# Altium schematic sheet Voltage_source.SchDoc
size A3; SheetNumber: 2; SheetTotal: 3
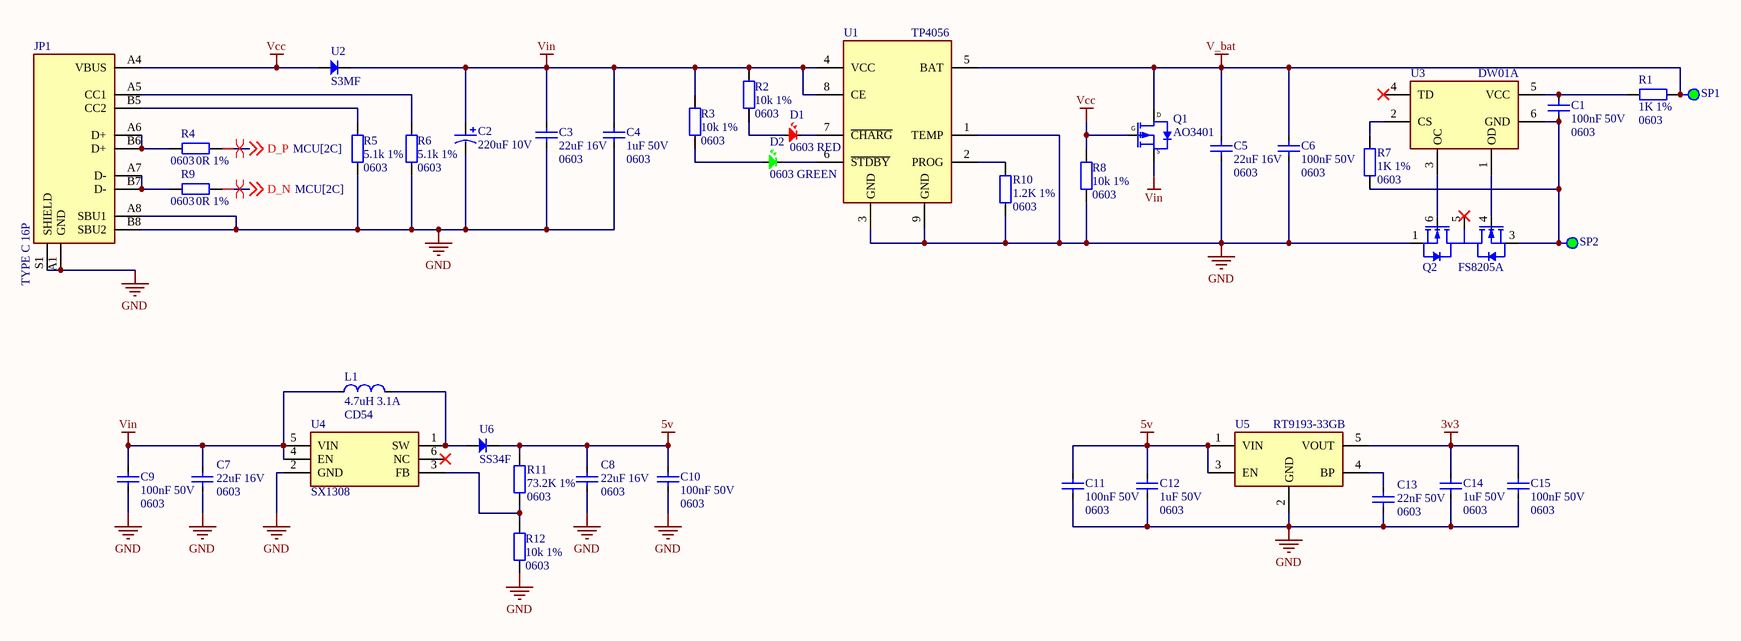
[diagram p0: Voltage_source.SchDoc]

## Parts
C1  100nF 50V  Package: 0603  [C_0603]
C2  220uF 10V  [CAP-ALU-SMD-D-NEW]
C3  22uF 16V  Package: 0603  [C_0603]
C4  1uF 50V  Package: 0603  [C_0603]
C5  22uF 16V  Package: 0603  [C_0603]
C6  100nF 50V  Package: 0603  [C_0603]
C7  22uF 16V  Package: 0603  [C_0603]
C8  22uF 16V  Package: 0603  [C_0603]
C9  100nF 50V  Package: 0603  [C_0603]
C10  100nF 50V  Package: 0603  [C_0603]
C11  100nF 50V  Package: 0603  [C_0603]
C12  1uF 50V  Package: 0603  [C_0603]
C13  22nF 50V  Package: 0603  [C_0603]
C14  1uF 50V  Package: 0603  [C_0603]
C15  100nF 50V  Package: 0603  [C_0603]
D1  0603 RED  [LED0603_RED]
D2  0603 GREEN  [LED0603_GREEN]
JP1  TYPE C 16P  [TYPE C 16P]
L1  4.7uH 3.1A  [CD54]
Q1  AO3401  [SOT23-3]
Q2  FS8205A  [SOT23-6]
R1  1K 1%  Package: 0603  [R_0603]
R2  10k 1%  Package: 0603  [R_0603]
R3  10k 1%  Package: 0603  [R_0603]
R4  0R 1%  Package: 0603  [R_0603]
R5  5.1k 1%  Package: 0603  [R_0603]
R6  5.1k 1%  Package: 0603  [R_0603]
R7  1K 1%  Package: 0603  [R_0603]
R8  10k 1%  Package: 0603  [R_0603]
R9  0R 1%  Package: 0603  [R_0603]
R10  1.2K 1%  Package: 0603  [R_0603]
R11  73.2K 1%  Package: 0603  [R_0603]
R12  10k 1%  Package: 0603  [R_0603]
SP1  SP  [SOLDERING PAD BIG 2]  (value not drawn)
SP2  SP  [SOLDERING PAD BIG 2]  (value not drawn)
U1  TP4056  [ESOP-8]
U2  S3MF  [SMAF_L3.5-W2.6-LS4.7-RD]
U3  DW01A  [SOT23-6]
U4  SX1308  [SOT23-6]
U5  RT9193-33GB  [SOT23-5]
U6  SS34F  [SMAF_L3.5-W2.6-LS4.7-RD]

## Nets
3v3: C14.2 C15.2 U5.5(VOUT)
5v: C8.2 C10.2 C11.2 C12.2 R11.2 U5.1(VIN) U5.3(EN) U6.1
GND: C2.2 C3.1 C4.1 C5.1 C6.1 C7.1 C8.1 C9.1 C10.1 C11.1 C12.1 C13.1 C14.1 C15.1 JP1.A1(GND) JP1.A8(SBU1) JP1.B8(SBU2) JP1.S1(SHIELD) Q2.1(S1) R5.1 R6.1 R8.2 R10.1 R12.1 U1.1(TEMP) U1.3(GND) U1.9(GND) U4.2(GND) U5.2(GND)
V_bat: C5.2 C6.2 Q1.3(D) R1.2 SP1.1 U1.5(BAT)
Vcc: JP1.A4(VBUS) Q1.1(G) R8.1 U2.2
Vin: C2.1 C3.2 C4.2 C7.2 C9.2 L1.1 Q1.2(S) R2.1 R3.1 U1.4(VCC) U1.8(CE) U2.1 U4.4(EN) U4.5(VIN)
D_N: R9.2 ; off-sheet D_N
D_P: R4.2 ; off-sheet D_P
NetC1_1: C1.1 Q2.3(S2) R7.1 SP2.1 U3.6(GND)
NetC1_2: C1.2 R1.1 U3.5(VCC)
NetC13_2: C13.2 U5.4(BP)
NetD1_1: D1.1 R2.2
NetD1_2: D1.2 U1.7(~{CHARG})
NetD2_1: D2.1 R3.2
NetD2_2: D2.2 U1.6(~{STDBY})
NetJP1_A5: JP1.A5(CC1) R6.2
NetJP1_A6: JP1.A6(D+) JP1.B6(D+) R4.1
NetJP1_A7: JP1.A7(D-) JP1.B7(D-) R9.1
NetJP1_B5: JP1.B5(CC2) R5.2
NetL1_2: L1.2 U4.1(SW) U6.2
NetQ2_4: Q2.4(G2) U3.1(OD)
NetQ2_6: Q2.6(G1) U3.3(OC)
NetR7_2: R7.2 U3.2(CS)
NetR10_2: R10.2 U1.2(PROG)
NetR11_1: R11.1 R12.2 U4.3(FB)

Not connected (* = marked no-connect by the designer): Q2 5(D1/D2)*; U3 4(TD)*; U4 6(NC)*

## Layout directives
differential pair: D_N, D_P

## Notes on the sheet
- Project Name:
- Author:
- Size:
- Date:
- Sheet Name:
- A3
- Time:
- Checked:
- Approved:
- Rev:
- Sheet:
- of:
- File:

## Library data of the parts
C1 C6 C9-C11 C15 = C0603_MLCC_100nF_50V: 50V 100nF X7R ±10% 0603 Multilayer Ceramic Capacitors MLCC - SMD/SMT ROHS; Manufacturer: YAGEO; Mrf.Part: CC0603KRX7R9BB104; Packaging: Cut Tape (CT); Link: https://www.lcsc.com/product-detail/Multilayer-Ceramic-Capacitors-MLCC-SMD-SMT_YAGEO-CC0603KRX7R9BB104_C14663.html?s_z=n_100nF%2050V%200603
C2 = C_ALU_220uF_10V_D: 220uF 10V ±20% SMD,D6.3xL7.7mm Aluminum Electrolytic Capacitors - SMD ROHS; Manufacturer: Honor Elec; Mrf.Part: RVT1A221M0607; Packaging: Cut Tape (CT); Link: https://www.lcsc.com/product-detail/Aluminum-Electrolytic-Capacitors-SMD_Honor-Elec-RVT1A221M0607_C87859.html?s_z=n_220uF; Package: D
C3 C5 C7 C8 = C0603_MLCC_22uF_16V: 16V 22uF X5R ±20% 0603 Multilayer Ceramic Capacitors MLCC - SMD/SMT ROHS; Manufacturer: Samsung Electro-Mechanics; Mrf.Part: CL10A226MO7JZNC; Packaging: Cut Tape (CT); Link: https://www.lcsc.com/product-detail/Multilayer-Ceramic-Capacitors-MLCC-SMD-SMT_Samsung-Electro-Mechanics-CL10A226MO7JZNC_C2762594.html?s_z=n_22uF%2050V%200603
C4 C12 C14 = C0603_MLCC_1uF_50V: 1 µF ±10% 50V Ceramic Capacitor X5R 0603 (1608 Metric); Manufacturer: Murata Electronics; Mrf.Part: GRT188R61H105KE13D; Packaging: Cut Tape (CT); Link: https://www.digikey.com/en/products/detail/murata-electronics/GRT188R61H105KE13D/5416752
C13 = C0603_MLCC_22nF_50V: 50V 22nF X7R ±10% 0603 Multilayer Ceramic Capacitors MLCC - SMD/SMT ROHS; Manufacturer: YAGEO; Mrf.Part: CC0603KRX7R9BB223; Packaging: Cut Tape (CT); Link: https://www.lcsc.com/product-detail/C106222.html?s_z=n_Yageo%2520C0603%252022nF; LCSC Part: C106222
D1 = L0603_RED: 20mA 330mcd Colorless Transparent Lens -20℃~+85℃ Positive Stick 620nm~630nm Red 120° 50mW 2.3V 0603 LED Indication - Discrete ROHS; Manufacturer: XINGLIGHT; Mrf.Part: XL-1608SURC-06; Packaging: Cut Tape (CT); Link: https://www.lcsc.com/product-detail/LED-Indication-Discrete_XINGLIGHT-XL-1608SURC-06_C965799.html?s_z=n_LED%200603%20red; Package: 0603
D2 = L0603_GREEN: 225mcd~450mcd Colorless Transparent Lens -40℃~+85℃ Positive Stick 520nm~535nm Green 120° 70mW 2.4V~3V 0603 LED Indication - Discrete ROHS; Manufacturer: Amicc; Mrf.Part: A-SP192DGHC-C01-4T; Packaging: Cut Tape (CT); Link: https://www.lcsc.com/product-detail/LED-Indication-Discrete_Amicc-A-SP192DGHC-C01-4T_C19171301.html?s_z=n_LED%200603%20green; Package: 0603
JP1 = TYPE_C_16P: USB-C (USB TYPE-C) USB 2.0 Receptacle Connector 24 (16+8 Dummy) Position Surface Mount, Right Angle; Through Hole; Manufacturer: Amphenol ICC (Commercial Products); Mrf.Part: 12402012E212A; Packaging: Cut Tape; Link: https://www.digikey.cn/en/products/detail/amphenol-cs-commercial-products/12402012E212A/13683192; Package: Plugin
L1 = CD54_4.7uH_3.1A: 3.1A 4.7uH ±20% SMD,5.8x5.2mm Power Inductors ROHS; Manufacturer: Ceaiya; Mrf.Part: CD54-4R7M; Packaging: Cut Tape; Link: https://www.lcsc.com/product-detail/Power-Inductors_Ceaiya-CD54-4R7M_C7588991.html?s_z=n_cd54%204.7uH; Inductor: 4.7uH; Current: 3.1A; Package: CD54
Q1 = AO3401: 30V 4.2A 42mΩ@10V,4A 1.4W 800mV@250uA 1 Piece P-Channel SOT-23 MOSFETs ROHS; Manufacturer: ElecSuper; Mrf.Part: AO3401; Packaging: Cut Tape (CT); Link: https://www.lcsc.com/product-detail/MOSFETs_ElecSuper-AO3401_C5224195.html; Drain Source Voltage (Vdss): 30V; Continuous Drain Current (Id): 4.2A; Power Dissipation (Pd): 1.4W; Package: SOT23-3
Q2 = FS8205A: 20V 25mΩ@2.5V,3A 1.5W 500mV SOT-23-6 MOSFETs ROHS; Manufacturer: TECH PUBLIC; Manufacture Part Number: FS8205A; Packaging: Cut Tape (CT); Link: https://www.lcsc.com/product-detail/MOSFETs_TECH-PUBLIC-FS8205A_C2830320.html?s_z=n_fs8205; Drain to Source Voltage: 20V; RDS(on): 25mΩ@2.5V,3A; Gate Threshold Voltage (Vgs(th)@Id): 500mV; Package: SOT-23-6
R1 R7 = R0603_1K: 1 kOhms ±1% 0.1W, 1/10W Chip Resistor 0603 (1608 Metric) Moisture Resistant Thick Film; Manufacturer: YAGEO; Mrf.Part: RC0603FR-071KL; Packaging: Cut Tape (CT); Link: https://www.digikey.com/en/products/detail/yageo/RC0603FR-071KL/726843; LCSC Part: C22548; Tolerance: ±1%
R2 R3 R8 R12 = R0603_10k: 100mW Thick Film Resistor 75V ±100ppm/℃ ±1% 10kΩ 0603 Chip Resistor - Surface Mount ROHS; Mrf.Part: RC0603FR-0710KL; Manufacturer: YAGEO; LCSC Part: C98220; Link: https://www.lcsc.com/product-detail/C98220.html?s_z=n_YAgeo%25200603%252010K; Packaging: Cut Tape; Tolerance: ±1%
R4 R9 = R0603_0R: 100mW Thick Film Resistor 75V ±1% 0Ω 0603 Chip Resistor - Surface Mount ROHS; Manufacturer: YAGEO; Mrf.Part: RC0603FR-070RL; Packaging: Cut Tape (CT); Link: https://www.lcsc.com/product-detail/C100044.html?s_z=n_yageo%25200603%25200R%25201%2525; LCSC Part: C100044; Tolerance: ±1%
R5 R6 = R0603_5.1k: 100mW Thick Film Resistor 75V ±100ppm/℃ ±1% 5.1kΩ 0603 Chip Resistor - Surface Mount ROHS; Mrf.Part: RC0603FR-075K1L; Manufacturer: YAGEO; LCSC Part: C105580; Link: https://www.lcsc.com/product-detail/C105580.html?s_z=n_Yageo%25200603%25205.1k%25201%2525; Packaging: Cut Tape; Tolerance: ±1%
R10 = R0603_1.2K: 1.2 kOhms ±1% 0.1W, 1/10W Chip Resistor 0603 (1608 Metric) Moisture Resistant Thick Film; Manufacturer: YAGEO; Mrf.Part: RC0603FR-071K2L; Packaging: Cut Tape (CT); Link: https://www.digikey.com/en/products/detail/yageo/RC0603FR-071K2L/726852; LCSC Part: C114605; Tolerance: ±1%
R11 = R0603_73.2K: 73.2 kOhms ±1% 0.1W, 1/10W Chip Resistor 0603 (1608 Metric) Moisture Resistant Thick Film; Manufacturer: YAGEO; Mrf.Part: RC0603FR-0773K2L; Packaging: Cut Tape (CT); Link: https://www.lcsc.com/product-detail/C163420.html?s_z=n_Yageo%25200603%252073.2K%25201%2525; LCSC Part: C163420; Tolerance: ±1%
SP1 SP2 = SOLDERING PAD
U1 = TP4056: ESOP-8 Battery Management ICs ROHS; Manufacturer: MSKSEMI; Mrf.Part: TP4056-MS; Packaging: Cut Tape (CT); Link: https://www.lcsc.com/product-detail/Battery-Management_MSKSEMI-TP4056-MS_C7473158.html?s_z=n_tp4056; Package: ESOP-8; LCSC Part: C7473158
U2 = S3MF: 3A Independent Type 1.1V@3A 1kV SMAF Diodes - General Purpose ROHS; Manufacturer: Shandong Jingdao Microelectronics; Mrf.Part: S3MF; Packaging: Cut Tape; Link: https://www.lcsc.com/product-detail/Diodes-General-Purpose_Shandong-Jingdao-Microelectronics-S3MF_C123928.html?s_z=n_s3m; Package: SMAF
U3 = DW01A: 1V~5.5V SOT-23-6 Battery Management ROHS; Manufacturer: PJSEMI; Mrf.Part: DW01A; Packaging: Cut Tape (CT); Link: https://www.lcsc.com/product-detail/Battery-Management_PJSEMI-DW01A_C41398501.html?s_z=n_dw01A; Package: SOT-23-6; LCSC Part: C41398501
U4 = SX1308: Boost type Adjustable 28V 2A 2V~24V SOT-23-6 DC-DC Converters ROHS; Manufacturer: SX(Shenzhen Suosemi Tech); Manufacture Part Number: SX1308; Packaging: Cut Tape; Link: https://www.lcsc.com/product-detail/DC-DC-Converters_SX-Shenzhen-Suosemi-Tech-SX1308_C78162.html?s_z=n_sx1308; Package: SOT-23-6
U5 = RT9193-33GB: 300mA -50dB@(10kHz) Fixed 3.3V Positive 5.5V SOT-23-5 Voltage Regulators - Linear, Low Drop Out (LDO) Regulators ROHS; Manufacturer: RICHTEK; Mrf.Part: RT9193-33GB; Packaging: Cut Tape; Link: https://www.lcsc.com/product-detail/C15651.html?s_z=n_RT9193; Package: SOT-23-5; LCSC Part: C15651
U6 = SS34F: 40V Independent Type 3A 700mV@3A SMAF Schottky Diodes ROHS; Manufacturer: HXY MOSFET; Mrf.Part: SS34F; Packaging: Cut Tape; Link: https://www.lcsc.com/product-detail/Schottky-Diodes_HXY-MOSFET-SS34F_C5766642.html?s_z=n_ss34; Package: SMAF